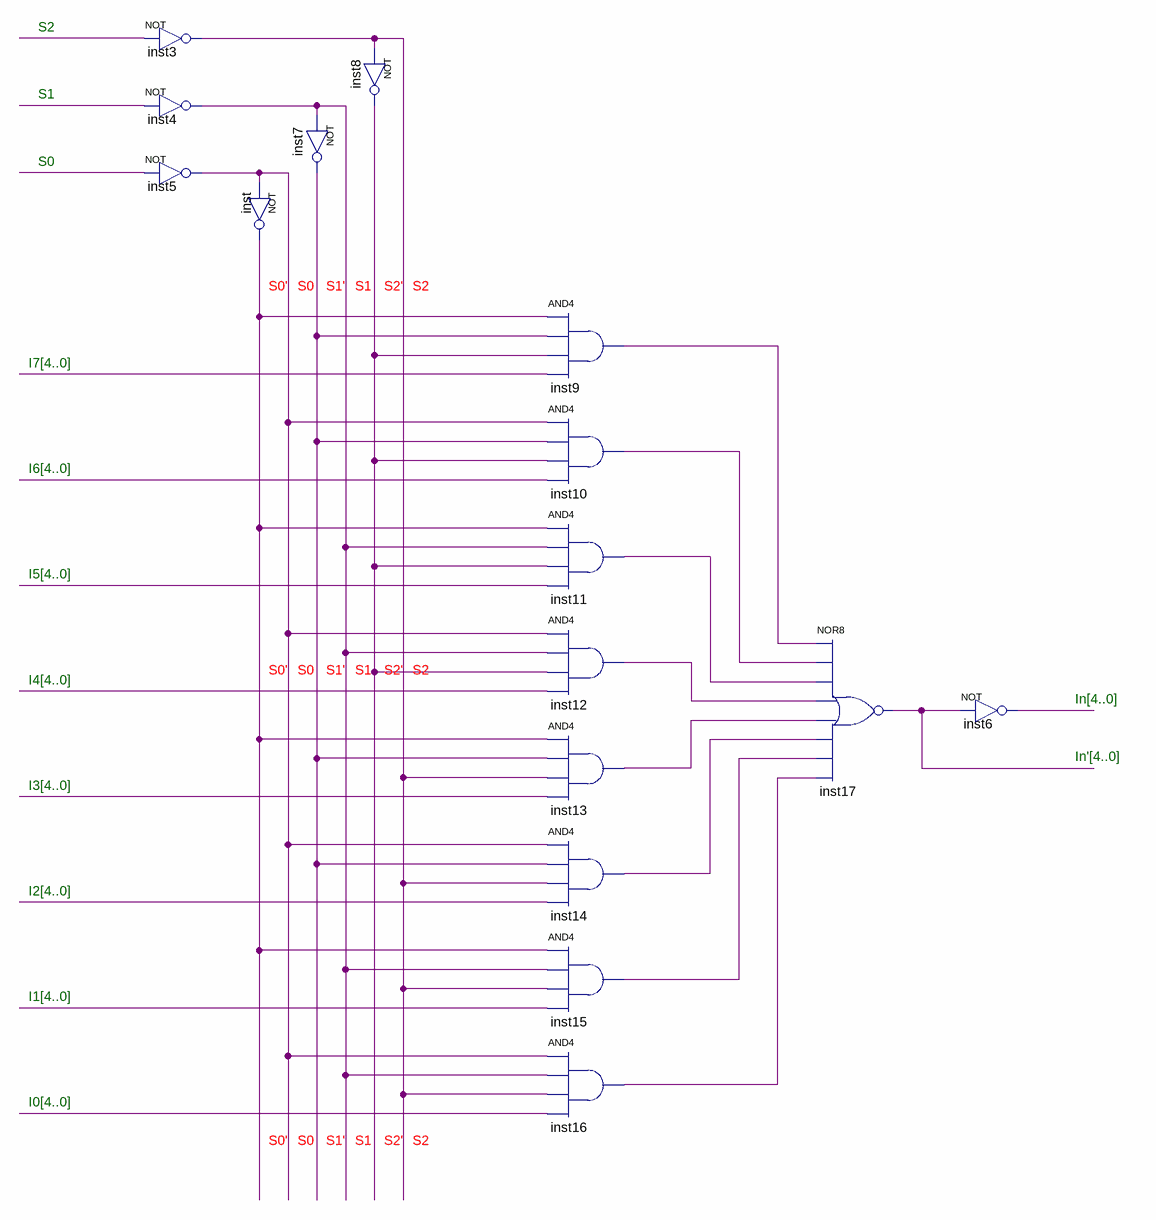
[diagram p0: schematic sheet]
// Quartus schematic mhrs_MUX_Final.bdf as structural Verilog: 16 symbols, 0 pins
module mhrs_MUX_Final (
);

  wire inst3_out, inst4_out, inst5_out, inst6_out, inst7_out, inst8_out, inst9_out, inst10_out, inst11_out,
       inst12_out, inst13_out, inst14_out, inst15_out, inst16_out, inst17_out, inst_out, undriven,
       undriven_2, undriven_3, undriven_4, undriven_5, undriven_6, undriven_7, undriven_8, undriven_9,
       undriven_10, undriven_11;

  not inst3 (inst3_out, undriven_8);
  not inst4 (inst4_out, undriven_9);
  not inst5 (inst5_out, undriven_10);
  not inst (inst_out, inst5_out);
  not inst7 (inst7_out, inst4_out);
  not inst8 (inst8_out, inst3_out);
  and inst9 (inst9_out, inst_out, inst7_out, inst8_out, undriven_11);
  and inst10 (inst10_out, inst5_out, inst7_out, inst8_out, undriven);
  and inst11 (inst11_out, inst_out, inst4_out, inst8_out, undriven_4);
  and inst12 (inst12_out, inst5_out, inst4_out, inst8_out, undriven_2);
  and inst13 (inst13_out, inst_out, inst7_out, inst3_out, undriven_5);
  and inst14 (inst14_out, inst5_out, inst7_out, inst3_out, undriven_6);
  and inst15 (inst15_out, inst_out, inst4_out, inst3_out, undriven_7);
  and inst16 (inst16_out, inst5_out, inst4_out, inst3_out, undriven_3);
  nor inst17 (inst17_out, inst9_out, inst10_out, inst11_out, inst12_out, inst13_out, inst14_out, inst15_out, inst16_out);
  not inst6 (inst6_out, inst17_out);

  // Notes on the sheet:
  //   S2
  //   S1
  //   S0
  //   S0'
  //   S0
  //   S1'
  //   S1
  //   S2'
  //   S2
  //   I7[4..0]
  //   I6[4..0]
  //   I5[4..0]
  //   S0'
  //   S0
  //   S1'
  //   S1
  //   S2'
  //   S2
  //   I4[4..0]
  //   In[4..0]
  //   In'[4..0]
  //   I3[4..0]
  //   I2[4..0]
  //   I1[4..0]
  //   I0[4..0]
  //   S0'
  //   S0
  //   S1'
  //   S1
  //   S2'
  //   S2
endmodule
